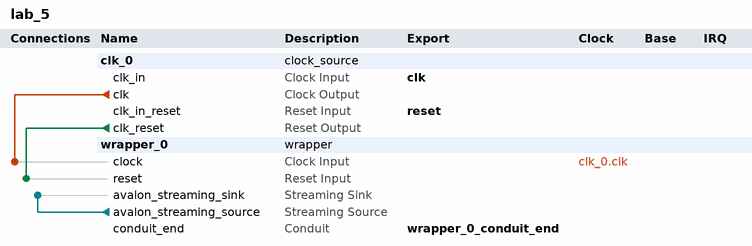
[diagram p0: system contents]
# Platform Designer (Qsys) system lab_5, Cyclone V 5CEBA2F17A7
# Parameters at their usual value, and those the tool derives, are not listed.
package require -exact qsys 16.0
create_system lab_5
set_project_property DEVICE_FAMILY {Cyclone V}
set_project_property DEVICE 5CEBA2F17A7

add_instance clk_0 clock_source 16.0
set_instance_parameter_value clk_0 clockFrequency 50000000

add_instance wrapper_0 wrapper 1.0

# connections
add_connection clk_0.clk wrapper_0.clock clock
add_connection clk_0.clk_reset wrapper_0.reset reset
add_connection wrapper_0.avalon_streaming_source wrapper_0.avalon_streaming_sink avalon_streaming

# exported interfaces
add_interface clk clock sink
set_interface_property clk EXPORT_OF clk_0.clk_in
add_interface reset reset sink
set_interface_property reset EXPORT_OF clk_0.clk_in_reset
add_interface wrapper_0_conduit_end conduit end
set_interface_property wrapper_0_conduit_end EXPORT_OF wrapper_0.conduit_end

set_interconnect_requirement {$system} qsys_mm.clockCrossingAdapter HANDSHAKE
set_interconnect_requirement {$system} qsys_mm.enableEccProtection FALSE
set_interconnect_requirement {$system} qsys_mm.insertDefaultSlave FALSE
set_interconnect_requirement {$system} qsys_mm.maxAdditionalLatency 1

save_system lab_5.qsys
